# EAGLE design 9x miniUSB v0.1 (EAGLE 7.0.0)
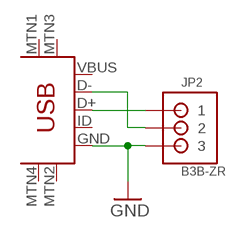
[diagram p0: schematic, sheet 1]

## Parts
JP2  B3B-ZR  [B3B-ZR]
X1  USB-MINIB-5PIN  [USB-MINIB]

## Nets
D+: JP2.1 X1.D+
D-: JP2.2 X1.D-
GND: JP2.3 X1.GND
Unconnected: X1.ID X1.MTN1(MTN2) X1.MTN2(MTN3) X1.MTN3(MTN1) X1.MTN4 X1.VBUS

## Library data of the parts
JP2 = jdc:B3B-ZR: JST-ZH Connector 3 pol, 1.5mm pitch Package: B3B-ZR Source: http://www.jst-mfg.com/product/pdf/eng/eZH.pdf
X1 = SparkFun-Connectors:USB-MINIB: Mini-USB "B" connector with 5th pin broken out. Created new symbol breaking out 5th "ID" pin in mini/micro USB connector spec. See: http://en.wikipedia.org/wiki/Mini_usb#Cables. Uses same footprint as 4-pin symbol. Also added pins to connect to mounting / shield pads if required (probably not generally needed as signals aren't shielded once they leave the connector).

## Net classes
0 default: width 0.203 mm

## Board
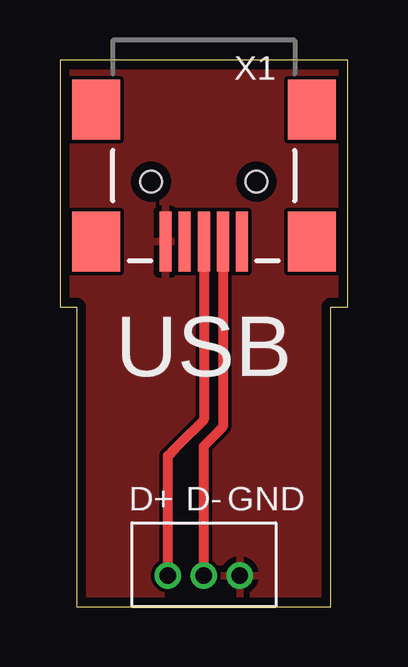
[diagram p1: board, top side]

Size 12 x 22.8 mm. Coordinates in mm from the lower left corner, seen from the top.
Outline: 0.7,0 11.3,0 11.3,12.5 12,12.5 12,22.8 0,22.8 0,12.5 0.7,12.5 0.7,0
Copper layers (1*16): Top 0.0356mm / dielectric 1.5011mm / Bottom 0.0356mm
Design rules "LaenPCBOrder *": minimum track width 6mil, minimum drill 13mil, track to track 6mil, track to pad 6mil, pad to pad 6mil, via to via 6mil, smd to smd 6mil, copper to edge 15mil, drill to drill 6mil, minimum pad ring 7mil, minimum via ring 7mil, stop-mask expansion 4mil, vias tented up to drill 24mil, thermal gap 10mil

### Footprints (pad centres in the part's own frame; a part is rotated, then mirrored left to right if it is on the bottom)
B3B-ZR = drill 0.7 pad 1.1: 1 1.5,0; 2 0,0; 3 -1.5,0
USB-MINIB = smd 2.5 x 0.5: D+ 2.5,0; D- 2.5,0.8; GND 2.5,-1.6; ID 2.5,-0.8; VBUS 2.5,1.6 | smd 2.5 x 2: MTN1 -3,4.5; MTN2 2.5,4.5; MTN3 -3,-4.5; MTN4 2.5,-4.5 | hole 0.9: 0,2.2; 0,-2.2

### Placement (x,y rotation side)
JP2  6,1.3 180 top
X1  6,17.72 270 top

### Tracks (layer width: path | path; a pad name or v marks a point on that pad's centre or on a via)
D+
  Top 0.406: X1.D+ 6,7.8 4.95,6.75 4.8,6.6 4.5,6.3 JP2.1
D-
  Top 0.406: X1.D- 6.8,7.5 6,6.7 JP2.2
GND
  pour Top: -0.5,23.3 12.7,23.3 12.7,-0.5 -0.5,-0.5

### Text on the board
tNames: USB | D+ | D- | GND